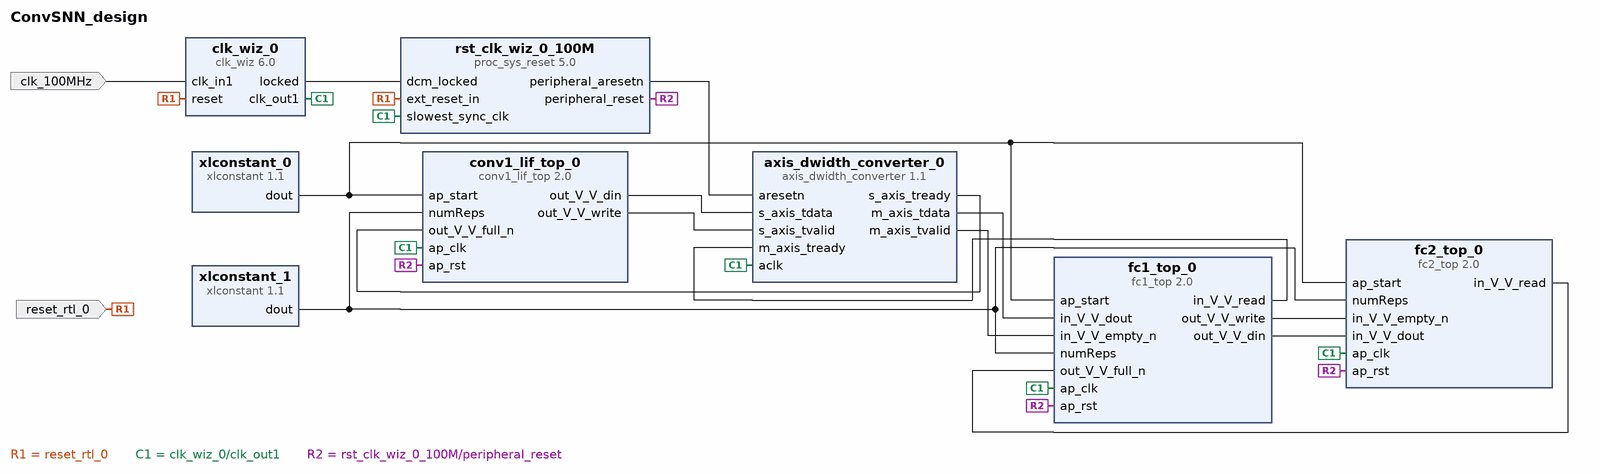
[diagram p0: block diagram of the top level]
# Vivado block design ConvSNN_design, xczu28dr-ffvg1517-2-e, Vivado 2020.1
create_bd_design ConvSNN_design

create_bd_port -dir I -type clk clk_100MHz
set_property -dict {CONFIG.FREQ_HZ 100000000} [get_bd_ports clk_100MHz]
create_bd_port -dir I -type rst reset_rtl_0
set_property -dict {CONFIG.POLARITY ACTIVE_HIGH} [get_bd_ports reset_rtl_0]

create_bd_cell -type ip -vlnv xilinx.com:hls:conv1_lif_top:2.0 conv1_lif_top_0
create_bd_cell -type ip -vlnv xilinx.com:hls:fc1_top:2.0 fc1_top_0
create_bd_cell -type ip -vlnv xilinx.com:hls:fc2_top:2.0 fc2_top_0
create_bd_cell -type ip -vlnv xilinx.com:ip:clk_wiz:6.0 clk_wiz_0
create_bd_cell -type ip -vlnv xilinx.com:ip:proc_sys_reset:5.0 rst_clk_wiz_0_100M
create_bd_cell -type ip -vlnv xilinx.com:ip:xlconstant:1.1 xlconstant_0
create_bd_cell -type ip -vlnv xilinx.com:ip:xlconstant:1.1 xlconstant_1
set_property -dict {CONFIG.CONST_WIDTH 32} [get_bd_cells xlconstant_1]
create_bd_cell -type ip -vlnv xilinx.com:ip:axis_dwidth_converter:1.1 axis_dwidth_converter_0
set_property -dict {CONFIG.M_TDATA_NUM_BYTES 40} [get_bd_cells axis_dwidth_converter_0]

# ---- connections ----

connect_bd_net [get_bd_ports clk_100MHz] [get_bd_pins clk_wiz_0/clk_in1]
connect_bd_net -net reset_rtl_0_1 [get_bd_ports reset_rtl_0] [get_bd_pins clk_wiz_0/reset] [get_bd_pins rst_clk_wiz_0_100M/ext_reset_in]
connect_bd_net [get_bd_pins clk_wiz_0/clk_out1] \
  [get_bd_pins conv1_lif_top_0/ap_clk] [get_bd_pins rst_clk_wiz_0_100M/slowest_sync_clk] [get_bd_pins fc1_top_0/ap_clk] \
  [get_bd_pins fc2_top_0/ap_clk] [get_bd_pins axis_dwidth_converter_0/aclk]
connect_bd_net [get_bd_pins clk_wiz_0/locked] [get_bd_pins rst_clk_wiz_0_100M/dcm_locked]
connect_bd_net [get_bd_pins xlconstant_0/dout] \
  [get_bd_pins conv1_lif_top_0/ap_start] [get_bd_pins fc1_top_0/ap_start] [get_bd_pins fc2_top_0/ap_start]
connect_bd_net [get_bd_pins xlconstant_1/dout] [get_bd_pins conv1_lif_top_0/numReps] [get_bd_pins fc1_top_0/numReps] [get_bd_pins fc2_top_0/numReps]
connect_bd_net [get_bd_pins conv1_lif_top_0/out_V_V_din] [get_bd_pins axis_dwidth_converter_0/s_axis_tdata]
connect_bd_net [get_bd_pins axis_dwidth_converter_0/m_axis_tdata] [get_bd_pins fc1_top_0/in_V_V_dout]
connect_bd_net [get_bd_pins conv1_lif_top_0/out_V_V_write] [get_bd_pins axis_dwidth_converter_0/s_axis_tvalid]
connect_bd_net [get_bd_pins axis_dwidth_converter_0/s_axis_tready] [get_bd_pins conv1_lif_top_0/out_V_V_full_n]
connect_bd_net [get_bd_pins axis_dwidth_converter_0/m_axis_tvalid] [get_bd_pins fc1_top_0/in_V_V_empty_n]
connect_bd_net [get_bd_pins fc1_top_0/out_V_V_write] [get_bd_pins fc2_top_0/in_V_V_empty_n]
connect_bd_net [get_bd_pins fc2_top_0/in_V_V_read] [get_bd_pins fc1_top_0/out_V_V_full_n]
connect_bd_net [get_bd_pins fc1_top_0/out_V_V_din] [get_bd_pins fc2_top_0/in_V_V_dout]
connect_bd_net [get_bd_pins fc1_top_0/in_V_V_read] [get_bd_pins axis_dwidth_converter_0/m_axis_tready]
connect_bd_net [get_bd_pins rst_clk_wiz_0_100M/peripheral_reset] \
  [get_bd_pins fc2_top_0/ap_rst] [get_bd_pins fc1_top_0/ap_rst] [get_bd_pins conv1_lif_top_0/ap_rst]
connect_bd_net [get_bd_pins rst_clk_wiz_0_100M/peripheral_aresetn] [get_bd_pins axis_dwidth_converter_0/aresetn]

validate_bd_design
save_bd_design
